# EAGLE design transmittor_distance (EAGLE 8.0.2)
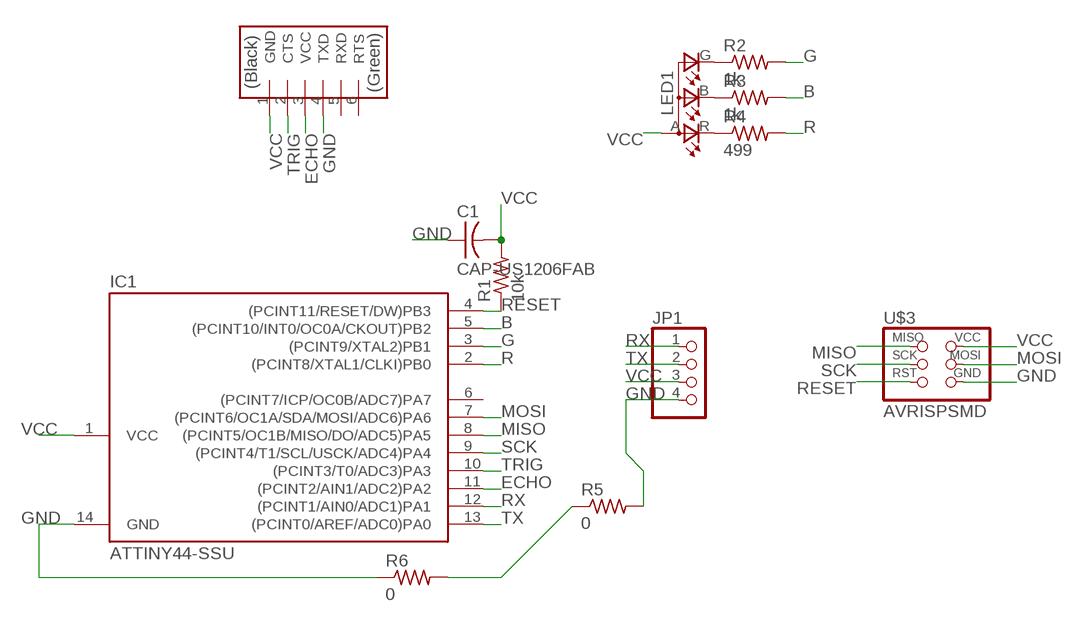
[diagram p0: schematic, sheet 1]

## Parts
C1  CAP-US1206FAB  [C1206FAB]
IC1  ATTINY44-SSU  [SOIC14]
JP1  PINHD-1X4  [1X04]
LED1  LEDRGBOLD  [P-LCC-4-3]
R1  10k  RES-US1206FAB  [R1206FAB]
R2  1k  RES-US1206FAB  [R1206FAB]
R3  1k  RES-US1206FAB  [R1206FAB]
R4  499  RES-US1206FAB  [R1206FAB]
R5  0  RES-US1206FAB  [R1206FAB]
R6  0  RES-US1206FAB  [R1206FAB]
U$1  FTDI-SMD-HEADER  [1X06SMD]
U$3  AVRISPSMD  [2X03SMD]

## Nets
B: IC1.5((PCINT10/INT0/OC0A/CKOUT)PB2) R3.2
ECHO: IC1.11((PCINT2/AIN1/ADC2)PA2) U$1.3(VCC)
G: IC1.3((PCINT9/XTAL2)PB1) R2.2
GND: C1.1 IC1.14(GND) JP1.4 R5.2 R6.1 U$1.4(TXD) U$3.6(GND)
MISO: IC1.8((PCINT5/OC1B/MISO/DO/ADC5)PA5) U$3.1(MISO)
MOSI: IC1.7((PCINT6/OC1A/SDA/MOSI/ADC6)PA6) U$3.4(MOSI)
N$1: R5.1 R6.2
N$2: LED1.G(CGREEN) R2.1
N$6: LED1.B(CBLUE) R3.1
N$7: LED1.R(CRED) R4.1
R: IC1.2((PCINT8/XTAL1/CLKI)PB0) R4.2
RESET: IC1.4((PCINT11/RESET/DW)PB3) R1.1 U$3.5(RST)
RX: IC1.12((PCINT1/AIN0/ADC1)PA1) JP1.1
SCK: IC1.9((PCINT4/T1/SCL/USCK/ADC4)PA4) U$3.3(SCK)
TRIG: IC1.10((PCINT3/T0/ADC3)PA3) U$1.2(CTS)
TX: IC1.13((PCINT0/AREF/ADC0)PA0) JP1.2
VCC: C1.2 IC1.1(VCC) JP1.3 LED1.A(A2) R1.2 U$1.1(GND) U$3.2(VCC)
Unconnected: IC1.6((PCINT7/ICP/OC0B/ADC7)PA7) U$1.5(RXD) U$1.6(RTS)

## Library data of the parts
C1 = fab:CAP-US
IC1 = fab:ATTINY44
JP1 = pinhead:PINHD-1X4: PIN HEADER
LED1 = fab:LEDRGBOLD: OSRAM Hyper Multi TOPLED® Hyper-Bright LED LATB T686 Source: http://www.osram.convergy.de/
R1-R6 = fab:RES-US: Resistor (US Symbol) Variants with postfix FAB are widened to allow the routing of internal traces
U$1 = fab:FTDI-SMD-HEADER
U$3 = fab:AVRISP

## Net classes
0 default: width 0.05 mm, clearance 0.5 mm

## Board
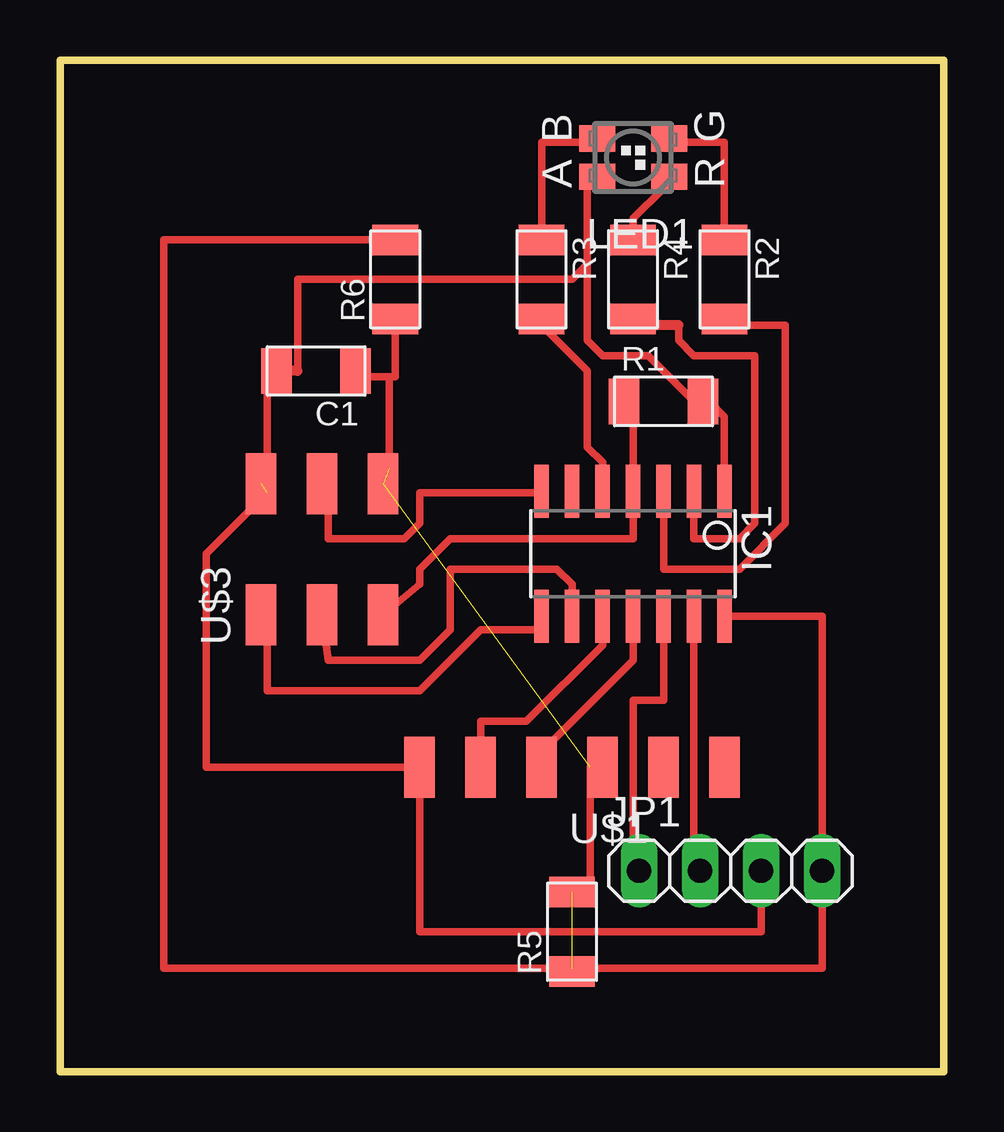
[diagram p1: board, top side]

Size 36.83 x 42.16 mm. Coordinates in mm from the lower left corner, seen from the top.
Outline: 36.83,42.16 36.83,0 0,0 0,42.16 36.83,42.16
Copper layers (1*16): Top 0.035mm / dielectric 1.5mm / Bottom 0.035mm
Design rules "fab": minimum track width 0.3mm, minimum drill 32mil, track to track 0.315mm, track to pad 0.315mm, pad to pad 0.315mm, via to via 0.315mm, smd to smd 0.315mm, copper to edge 40mil, drill to drill 16mil, minimum pad ring 10mil, minimum via ring 8mil, stop-mask expansion 4mil, vias tented up to drill 0mil, thermal gap 10mil

### Footprints (pad centres in the part's own frame; a part is rotated, then mirrored left to right if it is on the bottom)
C1206FAB = smd 1.27 x 1.905: 1 -1.651,0; 2 1.651,0
SOIC14 = smd 0.61 x 2.21: 1 -3.81,-2.603; 2 -2.54,-2.603; 3 -1.27,-2.603; 4 0,-2.603; 5 1.27,-2.603; 6 2.54,-2.603; 7 3.81,-2.603; 8 3.81,2.603; 9 2.54,2.603; 10 1.27,2.603; 11 0,2.603; 12 -1.27,2.603; 13 -2.54,2.603; 14 -3.81,2.603
1X04 = drill 1.016 long: 1 -3.81,0; 2 -1.27,0; 3 1.27,0; 4 3.81,0
P-LCC-4-3 = smd 1.1 x 1.5: A -0.8,1.5; B 0.8,1.5; G 0.8,-1.5; R -0.8,-1.5
R1206FAB = smd 1.27 x 1.905: 1 -1.651,0; 2 1.651,0
1X06SMD = smd 2.54 x 1.27: 1 0,6.35; 2 0,3.81; 3 0,1.27; 4 0,-1.27; 5 0,-3.81; 6 0,-6.35
2X03SMD = smd 2.54 x 1.27: 1 -2.54,2.54; 2 2.92,2.54; 3 -2.54,0; 4 2.92,0; 5 -2.54,-2.54; 6 2.92,-2.54

### Placement (x,y rotation side)
C1  10.67,29.21 180 top
IC1  23.88,21.59 180 top
JP1  27.94,8.38 0 top
LED1  23.88,38.1 90 top
R1  25.15,27.94 0 top
R2  27.69,33.02 270 top
R3  20.07,33.02 270 top
R4  23.88,33.02 270 top
R5  21.34,5.84 90 top
R6  13.97,33.02 90 top
U$1  21.34,12.7 90 top
U$3  10.92,21.59 90 top

### Tracks (layer width: path | path; a pad name or v marks a point on that pad's centre or on a via)
B
  Top 0.305: IC1.5 22.61,25.4 21.97,26.04 21.97,29.21 20.07,31.11 R3.2
ECHO
  Top 0.254: U$1.3 20.07,13.33
  Top 0.305: IC1.11 23.88,17.14 20.07,13.33
G
  Top 0.305: IC1.3 25.15,20.95 28.32,20.95 30.23,22.86 30.23,31.11 27.69,31.11 R2.2
GND  (3 unrouted)
  Top 0.254: 12.45,29.21 C1.1
  Top 0.305: IC1.14 31.75,18.99 JP1.4 31.75,4.32 21.34,4.32 | U$1.4 22.1,12.7 22.1,7.87 21.34,7.87 R5.2 | R6.1 13.97,28.96 | 13.97,28.96 12.32,28.96 C1.1 | 13.97,28.96 13.72,28.96 13.72,25.15
MISO
  Top 0.254: 20.07,18.41 IC1.8
  Top 0.305: 20.07,18.41 17.53,18.41 14.99,15.88 8.64,15.88 8.64,19.05 U$3.1
MOSI
  Top 0.254: 20.07,24.13 IC1.7
  Top 0.305: 20.07,24.13 14.99,24.13 14.99,22.86 14.35,22.22 11.18,22.22 11.18,24.51 U$3.4
N$1
  Top 0.305: R6.2 4.32,34.67 4.32,4.32 21.34,4.32 R5.1
N$2
  Top 0.305: R2.1 27.69,38.74 25.78,38.74 LED1.G
N$6
  Top 0.305: R3.1 20.07,38.74 21.97,38.74 LED1.B
N$7
  Top 0.305: R4.1 23.88,35.56 25.15,36.83 LED1.R
R
  Top 0.305: 25.78,31.11 25.78,30.48 26.42,29.84 28.96,29.84 28.96,22.86 28.32,22.22 26.42,22.22 IC1.2 | 23.88,31.11 R4.2
  Top 0.406: 25.78,31.11 23.88,31.11
RESET
  Top 0.254: 23.88,27.94 R1.1
  Top 0.305: 23.88,27.94 IC1.4 23.88,22.22 16.26,22.22 14.99,20.95 14.99,20.32 U$3.5
RX
  Top 0.305: JP1.1 23.88,8.38 23.88,15.49 25.15,15.49 IC1.12
SCK
  Top 0.305: IC1.9 21.34,20.32 20.7,20.95 16.26,20.95 16.26,18.41 14.99,17.14 11.18,17.14 U$3.3
TRIG
  Top 0.305: IC1.10 22.61,17.78 19.43,14.61 17.53,14.61 U$1.2
TX
  Top 0.305: IC1.13 26.42,9.14 26.67,9.14 JP1.2
VCC  (1 unrouted)
  Top 0.254: 27.05,27.94 R1.2 | 8.64,28.57 9.27,29.21 C1.2
  Top 0.305: 8.64,24.13 6.1,21.59 6.1,12.7 U$1.1 14.99,5.84 29.21,5.84 JP1.3 | 27.05,27.94 27.69,27.3 IC1.1 | 21.97,33.66 21.97,36.83 LED1.A | 21.97,33.66 21.34,33.02 9.91,33.02 9.91,29.21 | 21.97,33.66 21.97,30.48 22.61,29.84 24.51,29.84 26.42,27.94 R1.2 | U$3.2 8.64,24.51 8.64,28.57
  Top 0.406: 9.91,29.21 C1.2